# Altium schematic sheet Kilobot_Controller_CPU.SchDoc
size A4; PageSetup: Record=PageOptions|CenterHorizontal=True|CenterVertical=True|PrintScale=1.00|XCorrection=1.00|YCorrection=1.00|PrintKind=1|BorderSize=5000000|LeftOffset=0|BottomOffset=0|Orientation=2|PaperLength=1000|PaperWidth=1000|Scale=100|PaperSource=15|PrintQuality=600|MediaType=1|DitherType=10|PaperKind=A4|PrintScaleMode=1
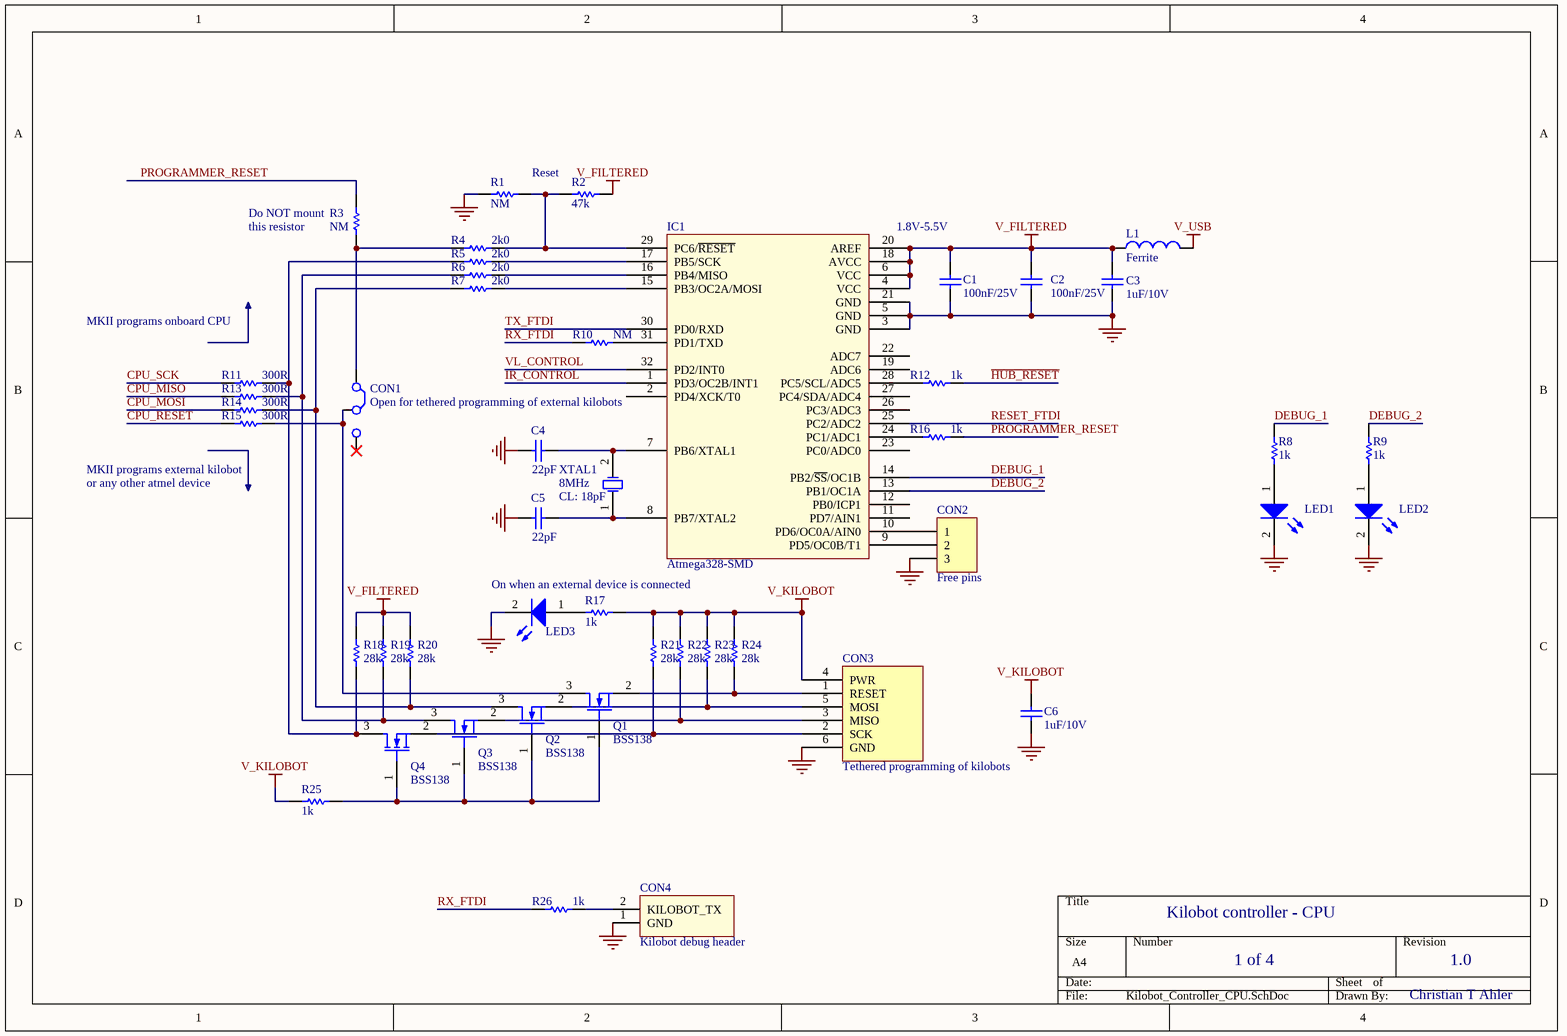
[diagram p0: Kilobot_Controller_CPU.SchDoc]

## Parts
C1  value 100nF/25V  [RESC1608L]  (hidden comment: C0603)
C2  value 100nF/25V  [RESC1608L]  (hidden comment: C0603)
C3  value 1uF/10V  [RESC1608L]  (hidden comment: C0603)
C4  value 22pF  [RESC1608L]  (hidden comment: C0603)
C5  value 22pF  [RESC1608L]  (hidden comment: C0603)
C6  value 1uF/10V  [RESC1608L]  (hidden comment: C0603)
CON1  (no value)  [HDR1X3]
CON2  Free pins  [HDR1X3]
CON3  Tethered programming of kilobots  [Programming]
CON4  Kilobot debug header  [HDR1X2]
IC1  Atmega328-SMD  [TQFP32]
L1  Ferrite  [RESC2012N]
LED1  LED  [LED0603]  (value not drawn)
LED2  LED  [LED0603]  (value not drawn)
LED3  LED  [LED0603]  (value not drawn)
Q1  value BSS138  [sot23-3]  (hidden comment: NMOS23)
Q2  value BSS138  [sot23-3]  (hidden comment: NMOS23)
Q3  value BSS138  [sot23-3]  (hidden comment: NMOS23)
Q4  value BSS138  [sot23-3]  (hidden comment: NMOS23)
R1  value NM  [RESC1608L]  (hidden comment: Res1)
R2  value 47k  [RESC1608L]  (hidden comment: Res1)
R3  value NM  [RESC1608L]  (hidden comment: Res1)
R4  value 2k0  [RESC1608L]  (hidden comment: Res1)
R5  value 2k0  [RESC1608L]  (hidden comment: Res1)
R6  value 2k0  [RESC1608L]  (hidden comment: Res1)
R7  value 2k0  [RESC1608L]  (hidden comment: Res1)
R8  value 1k  [RESC1608L]  (hidden comment: Res1)
R9  value 1k  [RESC1608L]  (hidden comment: Res1)
R10  value NM  [RESC1608L]  (hidden comment: Res1)
R11  value 300R  [RESC1608L]  (hidden comment: Res1)
R12  value 1k  [RESC1608L]  (hidden comment: Res1)
R13  value 300R  [RESC1608L]  (hidden comment: Res1)
R14  value 300R  [RESC1608L]  (hidden comment: Res1)
R15  value 300R  [RESC1608L]  (hidden comment: Res1)
R16  value 1k  [RESC1608L]  (hidden comment: Res1)
R17  value 1k  [RESC1608L]  (hidden comment: Res1)
R18  value 28k  [RESC1608L]  (hidden comment: Res1)
R19  value 28k  [RESC1608L]  (hidden comment: Res1)
R20  value 28k  [RESC1608L]  (hidden comment: Res1)
R21  value 28k  [RESC1608L]  (hidden comment: Res1)
R22  value 28k  [RESC1608L]  (hidden comment: Res1)
R23  value 28k  [RESC1608L]  (hidden comment: Res1)
R24  value 28k  [RESC1608L]  (hidden comment: Res1)
R25  value 1k  [RESC1608L]  (hidden comment: Res1)
R26  value 1k  [RESC1608L]  (hidden comment: Res1)
XTAL1  value 8MHz  CL: 18pF  [crystal-hc49]  (hidden comment: Crystal)

## Nets
GND: C1.2 C2.2 C3.1 C4.1 C5.1 C6.2 CON2.3 CON3.6(GND) CON4.1(GND) IC1.3(GND) IC1.5(GND) IC1.21(GND) LED1.2(K) LED2.2(K) LED3.2(K) R1.2
V_FILTERED: C1.1 C2.1 C3.2 IC1.4(VCC) IC1.6(VCC) IC1.18(AVCC) IC1.20(AREF) L1.1 R2.1 R18.2 R19.2 R20.2
V_KILOBOT: C6.1 CON3.4(PWR) R17.1 R21.2 R22.2 R23.2 R24.2 R25.1
V_USB: L1.2
CPU_MISO: R13.2
CPU_MOSI: R14.2
CPU_RESET: R15.2
CPU_SCK: R11.2
DEBUG_1: IC1.14(PB2/~{SS}/OC1B) R8.2
DEBUG_2: IC1.13(PB1/OC1A) R9.2
~{HUB_RESET}: R12.2
IR_CONTROL: IC1.1(PD3/OC2B/INT1)
PROGRAMMER_RESET: R3.2 R16.2
RESET_FTDI: IC1.25(PC2/ADC2)
RX_FTDI: R10.2 R26.2
TX_FTDI: IC1.30(PD0/RXD)
VL_CONTROL: IC1.32(PD2/INT0)
NetC4_2: C4.2 IC1.7(PB6/XTAL1) XTAL1.2(OSC2)
NetC5_2: C5.2 IC1.8(PB7/XTAL2) XTAL1.1(OSC1)
NetCON1_1: CON1.1(C1) R3.1 R4.2
NetCON1_2: CON1.2(C2) Q1.3(D) R15.1
NetCON2_1: CON2.1 IC1.10(PD6/OC0A/AIN0)
NetCON2_2: CON2.2 IC1.9(PD5/OC0B/T1)
NetCON3_1: CON3.1(RESET) Q1.2(S) R24.1
NetCON3_2: CON3.2(SCK) Q4.2(S) R21.1
NetCON3_3: CON3.3(MISO) Q3.2(S) R22.1
NetCON3_5: CON3.5(MOSI) Q2.2(S) R23.1
NetCON4_2: CON4.2(KILOBOT_TX) R26.1
NetIC1_15: IC1.15(PB3/OC2A/MOSI) R7.1
NetIC1_16: IC1.16(PB4/MISO) R6.1
NetIC1_17: IC1.17(PB5/SCK) R5.1
NetIC1_24: IC1.24(PC1/ADC1) R16.1
NetIC1_28: IC1.28(PC5/SCL/ADC5) R12.1
NetIC1_29: IC1.29(PC6/~{RESET}) R1.1 R2.2 R4.1
NetIC1_31: IC1.31(PD1/TXD) R10.1
NetLED1_1: LED1.1(A) R8.1
NetLED2_1: LED2.1(A) R9.1
NetLED3_1: LED3.1(A) R17.2
NetQ1_1: Q1.1(G) Q2.1(G) Q3.1(G) Q4.1(G) R25.2
NetQ2_3: Q2.3(D) R7.2 R14.1 R20.1
NetQ3_3: Q3.3(D) R6.2 R13.1 R19.1
NetQ4_3: Q4.3(D) R5.2 R11.1 R18.1

Not connected (* = marked no-connect by the designer): CON1 3(C3)*; IC1 2(PD4/XCK/T0) 11(PD7/AIN1) 12(PB0/ICP1) 19(ADC6) 22(ADC7) 23(PC0/ADC0) 26(PC3/ADC3) 27(PC4/SDA/ADC4)

## Notes on the sheet
- Reset
- (near R3) Do NOT mount
- (near R3) this resistor
- 1.8V-5.5V
- MKII programs onboard CPU
- (near IC1) Open for tethered programming of external kilobots
- MKII programs external kilobot
- or any other atmel device
- On when an external device is connected
- Kilobot controller - CPU
- 1 of 4
- 1.0
- Christian T Ahler

## Library data of the parts
C1 C2 = C0603: Ceramic Chip Capacitor - Standard; Order code: 445-1316-1-ND
C3 C6 = C0603: Ceramic Chip Capacitor - Standard; Order code: 445-1328-1-ND
C4 C5 = C0603: Ceramic Chip Capacitor - Standard; Order code: 445-1273-1-ND
CON1 = Jumper3: Value: Int/Ext programming; Order code: 3 pin jumper
CON2 = Header 3: Header, 3-Pin; Value: Free pins; Order code: Free pins
CON3 = Programming con new symbol: Value: Programming connector; Order code: 2x3 position pin header
CON4 = Kilobot_Debug_Header: Value: Debugging connector; Order code: 2 position pin header
IC1 = Atmega328-SMD: Order code: ATMEGA328-AU-ND; Value: Atmega328
L1 = Inductor: Value: 1k @ 100MHz; Order code: 445-5223-1-ND
LED1-LED3 = LED: Value: LED Green; Order code: 475-1409-1-ND
Q1-Q4 = NMOS23: Order code: BSS138KCT-ND
R1 R3 R10 = Res1: Resistor; Order code: DNO
R2 = Res1: Resistor; Order code: P47.0KHCT-ND
R4-R7 = Res1: Resistor; Order code: P2.0KGCT-ND
R8 R9 R12 R16 R17 R25 R26 = Res1: Resistor; Order code: P1.00KHCT-ND
R11 R13-R15 = Res1: Resistor; Order code: P300GCT-ND
R18-R24 = Res1: Resistor; Order code: P28.0KHCT-ND
XTAL1 = Crystal: Order code: 535-10212-1-ND